# EAGLE design door (EAGLE 9.1.3)
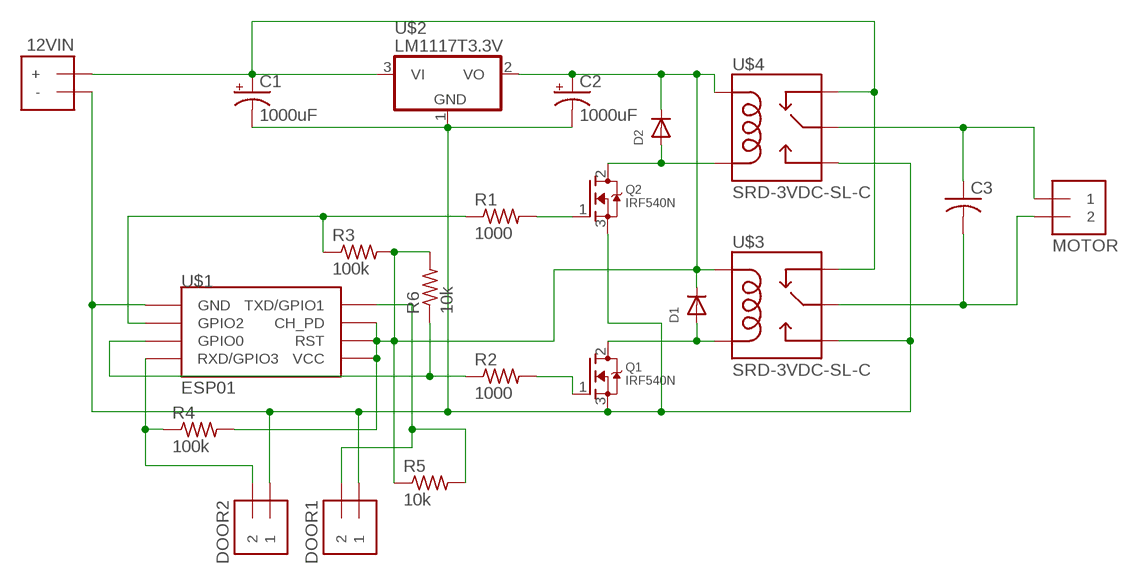
[diagram p0: schematic, sheet 1]

## Parts
12VIN  1X2_-++-  [1X2_+-]
C1  1000uF  CPOL-USE5-10.5  [E5-10,5]
C2  1000uF  CPOL-USE5-10.5  [E5-10,5]
C3  C-US150-054X183  [C150-054X183]
D1  DIODEDO-1N4148  [DO-1N4148]
D2  DIODEDO-1N4148  [DO-1N4148]
DOOR1  1X2_1212  [1X2_12]
DOOR2  1X2_1212  [1X2_12]
MOTOR  1X2_1221  [1X2_21]
Q1  IRF540N  MOSFET-NGDS_TO220V  [TO220V]
Q2  IRF540N  MOSFET-NGDS_TO220V  [TO220V]
R1  1000  R-US_0207/12  [0207/12]
R2  1000  R-US_0207/12  [0207/12]
R3  100k  R-US_0204/7  [0204/7]
R4  100k  R-US_0207/12  [0207/12]
R5  10k  R-US_0204/7  [0204/7]
R6  10k  R-US_0204/7  [0204/7]
U$1  ESP01  [ESP01]
U$2  LM1117T3.3V  LD1117  [TO220V]
U$3  SRD-3VDC-SL-C  RELAYPTH  [SRD-05VDC-SL-C]
U$4  SRD-3VDC-SL-C  RELAYPTH  [SRD-05VDC-SL-C]

## Nets
N$1: C2.+ D1.C D2.C R3.2 R4.2 R5.1 R6.2 U$1.CH_PD U$1.RST U$1.VCC U$2.2(VO) U$3.COIL1 U$4.COIL1
N$2: D2.A Q2.2(D) U$4.COIL0
N$3: D1.A Q1.2(D) U$3.COIL0
N$5: 12VIN.+ C1.+ U$2.3(VI) U$3.SWCLOSED(SWCLOSE) U$4.SWCLOSED(SWCLOSE)
N$8: 12VIN.- C1.- C2.- DOOR1.1 DOOR2.1 Q1.3(S) Q2.3(S) U$1.GND U$2.1(GND) U$3.SWOPEN U$4.SWOPEN
N$9: C3.1 MOTOR.1 U$4.SWCOMMON
N$10: C3.2 MOTOR.2 U$3.SWCOMMON
N$12: Q1.1(G) R2.2
N$13: Q2.1(G) R1.2
N$14: R1.1 R3.1 U$1.GPIO2
N$15: R2.1 R6.1 U$1.GPIO0
N$16: DOOR2.2 R4.1 U$1.RX(RXD/GPIO3)
N$17: DOOR1.2 R5.2 U$1.TX(TXD/GPIO1)

## Library data of the parts
12VIN = aaaacustom:1X2_-+
C1 C2 = adafruit:CPOL-US: POLARIZED CAPACITOR, American symbol
C3 = adafruit:C-US: CAPACITOR, American symbol
D1 D2 = adafruit:DIODE: Diode SMADIODE - SMA Surface Mount Package 20V 1A Schottky Diode Digikey: 641-1014-6-ND DO-1N4148 - Through Hole Small Current Diode SOD-123 20V 1 A (.5mV Vf) Schottky Diode - Digikey: MBRX120TPMSCT-ND SOD-323 10V 570mA (.38mV Vf, 3ns) Schottky Diode - Digikey: ZLLS410CT-ND SOD-523 30V 30mA Schottky Diode (RB751S-40TE61) - Digikey: RB751S-40TE61CT-ND SOT23-R/W - SOT23 Package (R = Solder Paste/Reflow Ovens, W = Hand-Soldering) BAT54Film 40V 300mA - Digikey: 497-7162-1-ND
DOOR1 DOOR2 MOTOR = aaaacustom:1X2_12: 3.5mm Terminal block http://www.ladyada.net/library/pcb/eaglelibrary.html
Q1 Q2 = adafruit:MOSFET-N: N-Channel Mosfet 2N7002E - 60V 260mA SOT23 [Digikey: 2N7002ET1GOSTR-ND] - REEL BSH103 - 30V 850mA SOT23 [Digikey: 568-5013-1-ND]
R1-R6 = adafruit:R-US_: RESISTOR, American symbol
U$1 = esp8266modules:ESP01: ESP8266 Wifi module 01
U$2 = adafruit:LD1117
U$3 U$4 = SRD05VDCSLC:RELAY: SPDT relay (COM-00101)

## Board
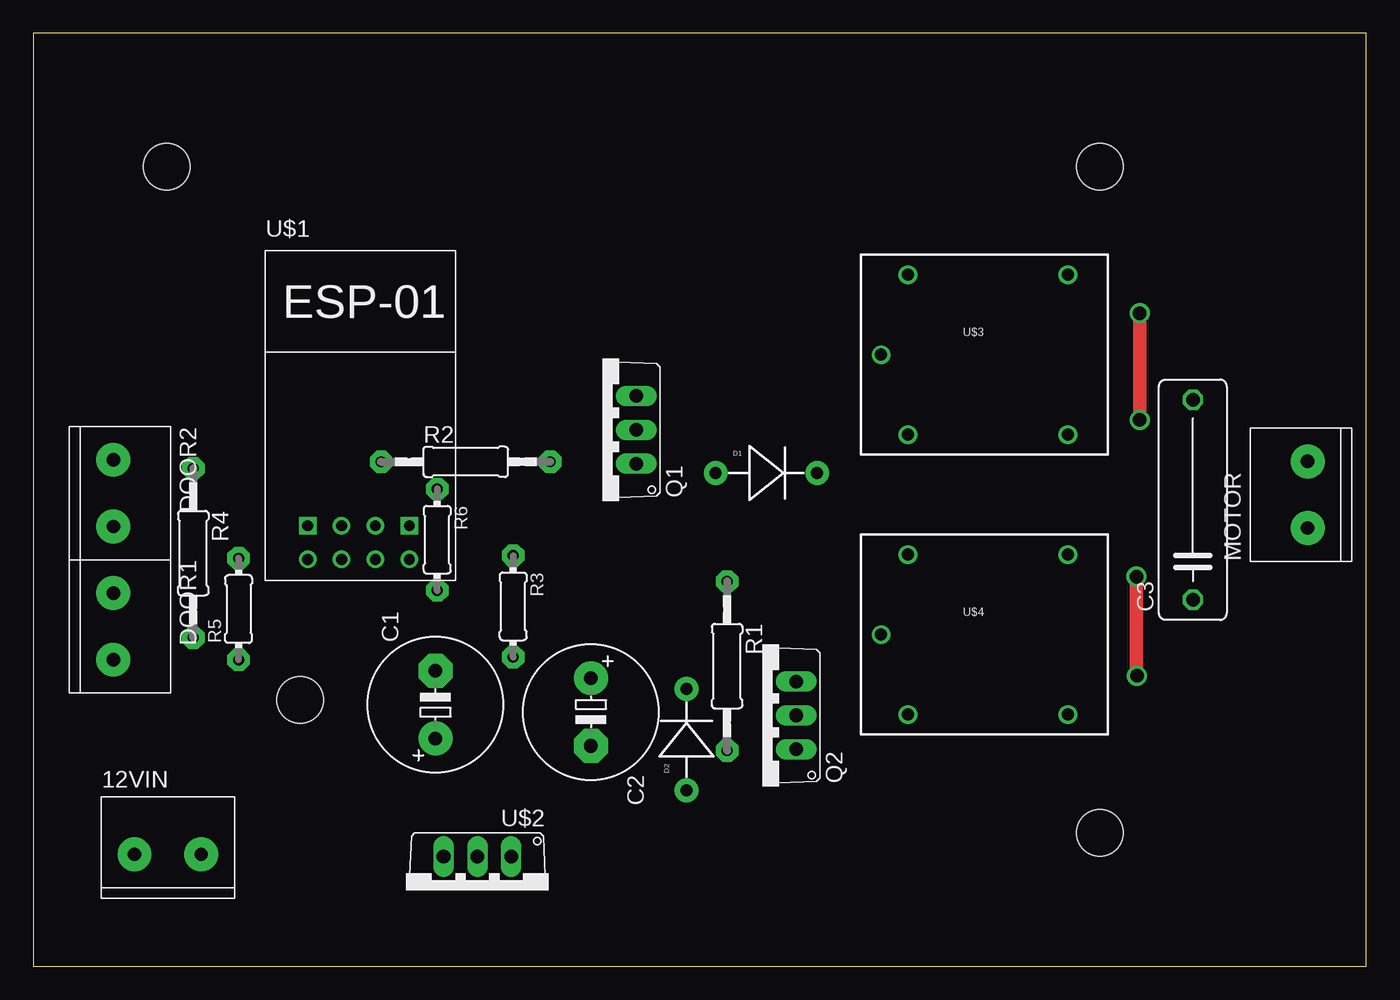
[diagram p1: board, top side]
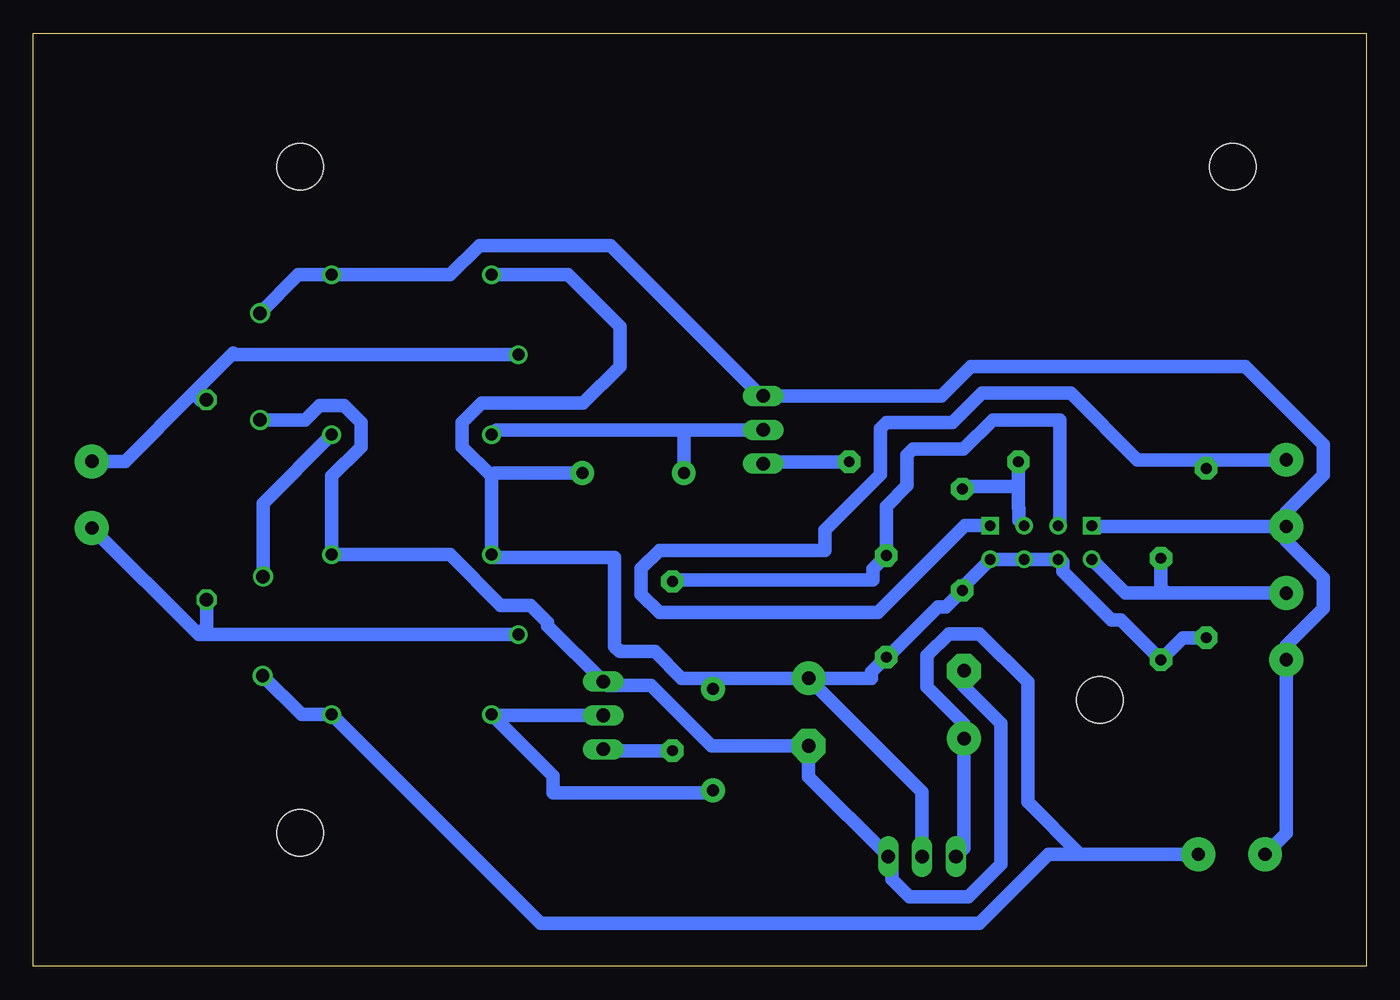
[diagram p2: board, bottom side, seen from below]

Size 100 x 70 mm. Coordinates in mm from the lower left corner, seen from the top.
Outline: 0,0 100,0 100,70 0,70 0,0
Copper layers (1*16): Top 0.035mm / dielectric 1.5mm / Bottom 0.035mm
Design rules "default": minimum track width 1mm, minimum drill 1mm, track to track 1mm, track to pad 1mm, pad to pad 0.5mm, via to via 1mm, smd to smd 6mil, copper to edge 0.5mm, drill to drill 0.5mm, minimum pad ring 10mil, minimum via ring 8mil, stop-mask expansion 4mil, vias tented up to drill 0mil, thermal gap 10mil
Holes 3.5 mm at 20,20 80,10 10,60 80,60

### Footprints (pad centres in the part's own frame; a part is rotated, then mirrored left to right if it is on the bottom)
1X2_+- = drill 1 pad 2.54: + 0,0; - 5,0
E5-10,5 = drill 1.016 pad 2.54: + -2.54,0 | drill 1.016 pad 2.54 octagon: - 2.54,0
C150-054X183 = drill 1.016 octagon: 1 -7.493,0; 2 7.493,0
DO-1N4148 = drill 0.9 pad 1.778: A -3.81,0; C 3.81,0
1X2_12 = drill 1 pad 2.54: 1 0,0; 2 5,0
1X2_21 = drill 1 pad 2.54: 1 5,0; 2 0,0
TO220V = drill 1.016 long: 1 -2.54,-2.54; 2 0,-2.54; 3 2.54,-2.54
0207/12 = drill 0.813 pad 1.676 octagon: 1 -6.35,0; 2 6.35,0
0204/7 = drill 0.813 pad 1.676 octagon: 1 -3.81,0; 2 3.81,0
ESP01 = drill 0.8: CH_PD -1.285,-8.178; GPIO0 1.255,-5.638; GPIO2 -1.285,-5.638; RST 1.255,-8.178; TX -3.825,-8.178; VCC 3.795,-8.178 | drill 0.8 square: GND -3.825,-5.638; RX 3.795,-5.638
SRD-05VDC-SL-C = drill 0.9: COIL0 -5.39,-6.12; COIL1 -5.39,5.88; SWCLOSED 6.61,-6.12; SWCOMMON -7.39,-0.12; SWOPEN 6.61,5.88

### Placement (x,y rotation side)
12VIN  12.59,8.39 180 top
C1  30.17,19.63 90 top
C2  41.83,19.07 270 top
C3  87,35 90 top
D1  55,37 0 top
D2  49,17 90 top
DOOR1  6,23 90 top
DOOR2  6,33 90 top
MOTOR  95.61,37.88 270 top
Q1  42.69,40.25 90 top
Q2  54.69,18.82 90 top
R1  52.05,22.52 270 top
R2  32.44,37.85 0 top
R3  36,27 270 top
R4  12,31 270 top
R5  15.4,26.8 90 top
R6  30.3,32 270 top
U$1  24.41,38.7 0 top
U$2  33.32,5.69 180 top
U$3  71,46 0 top
U$4  71,25 0 top

### Tracks (layer width: path | path; a pad name or v marks a point on that pad's centre or on a via)
N$1
  Bottom 1: C2.+ 33.32,13.1 U$2.2 | C2.+ 37.12,21.61 37.12,22.07 R3.2 35.9,23.19 32.15,26.94 31.55,26.94 R6.2 30.3,28.43 U$1.VCC U$1.RST U$1.CH_PD 22.93,30.52 22.74,30.33 22.74,29.63 19.11,26 18.41,26 R5.1 13.74,24.65 R4.2 | U$4.COIL1 65.61,36.76 | 65.61,36.76 67.81,38.97 67.81,40.79 66.36,42.25 58.75,42.25 56,45 56,48 59.88,51.88 U$3.COIL1 | 49,21.61 51.35,21.61 53.37,23.62 56,23.62 56.39,24.01 56.39,30.67 65.4,30.67 U$4.COIL1 | 49,21.61 C2.+ | U$4.COIL1 65.49,31 | D1.C 65.37,37 65.61,36.76 | D2.C 49,21.61
N$2
  Bottom 1: Q2.2 65.55,18.82 | 65.55,18.82 U$4.COIL0 | D2.A 49.19,13 61,13 61,14.27 65.55,18.82
N$3
  Bottom 1: Q1.2 51,40.25 | 51,40.25 65.24,40.25 U$3.COIL0 | D1.A 51.19,40.06 51,40.25
N$5  (via drill 1)
  Top 1: v82.77,29.23 82.77,21.83 v82.8,21.8
  Bottom 1: U$2.3 30.17,8.84 C1.+ 30.17,18.18 32.94,20.95 32.94,23.32 31.32,24.94 29.02,24.94 25.4,21.32 25.4,12.32 21.47,8.39 21,8.39 | 12VIN.+ 21,8.39 | 21,8.39 23.83,8.39 29.02,3.21 61.94,3.21 U$4.SWCLOSED 79.88,18.88 v82.8,21.8 | U$3.SWCLOSED 82.77,34.72 v82.77,29.23
N$8  (via drill 1)
  Top 1: v83,41 v83,49
  Bottom 1: C1.- 30.17,21.01 27.4,18.24 27.4,7.65 29.84,5.21 34.26,5.21 35.58,6.53 35.58,7.95 U$2.1 41.83,14.2 C2.- 49.1,16.53 53.66,21.08 56.95,21.08 Q2.3 61.41,25.54 61.41,25.79 62.7,27.08 64.93,27.08 68.73,30.88 U$4.SWOPEN 77.61,36.76 75.41,38.97 75.41,40.79 76.7,42.08 78.52,42.08 79.61,41 v83,41 | DOOR2.1 6,31.92 3.23,29.15 3.23,26.85 6,24.08 DOOR1.1 6,9.98 12VIN.- | DOOR2.1 20.52,33 U$1.GND | DOOR2.1 6,34.08 3.23,36.85 3.23,39.15 9.08,45 29.66,45 31.87,42.79 Q1.3 45.4,42.79 56.7,54.08 66.52,54.08 68.73,51.88 U$3.SWOPEN 80.12,51.88 v83,49
N$9
  Bottom 1: U$4.SWCOMMON 87.61,24.88 | 87.61,24.88 MOTOR.1 | C3.1 87,25.49 87.61,24.88
N$10
  Bottom 1: U$3.SWCOMMON 84.88,45.88 85,46 88,43 | 88,43 93.12,37.88 MOTOR.2 | C3.2 87.49,42.49 88,43
N$12
  Bottom 1: R2.2 45.09,37.85 Q1.1
N$13
  Bottom 1: R1.2 57.12,16.17 Q2.1
N$14
  Bottom 1: R1.1 51.92,29 37,29 37,29.81 R3.1 36,34.51 34.45,36.05 34.45,38.34 34,38.79 30.21,38.79 28,41 23,41 23,33.19 U$1.GPIO2
N$15
  Bottom 1: R2.1 26.09,36 | 26.09,36 26.09,34.38 26.05,34.34 26.05,33.45 U$1.GPIO0 | R6.1 30.11,36 26.09,36
N$16
  Bottom 1: DOOR2.2 12,38 | 12,38 17.17,38 22.17,43 28.83,43 31.04,40.79 36,40.79 36.45,40.34 36.45,36.88 40.62,32.71 40.62,31.21 53.02,31.21 54.39,29.84 54.39,27.9 53.02,26.53 36.64,26.53 30.11,33.06 U$1.RX | R4.1 12,38
N$17
  Bottom 1: DOOR1.2 15,28 | 15,28 18.06,28 U$1.TX | R5.2 15.4,28.4 15,28